# EAGLE design 12c_extender (EAGLE 7.1.0)
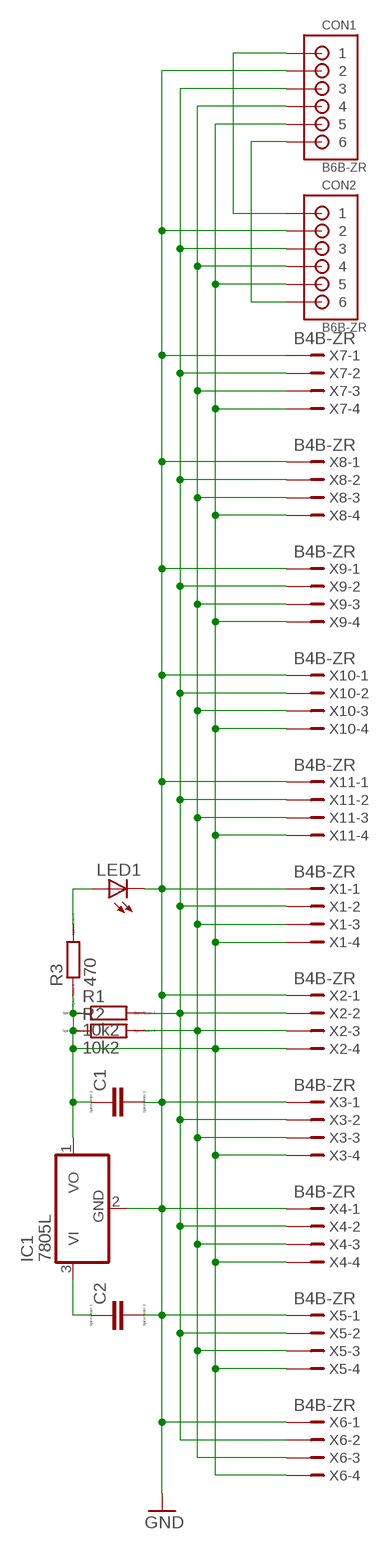
[diagram p0: schematic, sheet 1]

## Parts
C1  C-EUC0805  [C0805]
C2  C-EUC0805  [C0805]
CON1  B6B-ZR  [B6B-ZR]
CON2  B6B-ZR  [B6B-ZR]
IC1  7805L  [TO92]
LED1  LEDSMT1206  [1206]
R1  10k2  R-EU_R0805  [R0805]
R2  10k2  R-EU_R0805  [R0805]
R3  470  R-EU_R0805  [R0805]
X1  B4B-ZR  [B4B-ZR]
X2  B4B-ZR  [B4B-ZR]
X3  B4B-ZR  [B4B-ZR]
X4  B4B-ZR  [B4B-ZR]
X5  B4B-ZR  [B4B-ZR]
X6  B4B-ZR  [B4B-ZR]
X7  B4B-ZR  [B4B-ZR]
X8  B4B-ZR  [B4B-ZR]
X9  B4B-ZR  [B4B-ZR]
X10  B4B-ZR  [B4B-ZR]
X11  B4B-ZR  [B4B-ZR]

## Nets
+5V: C1.1 CON1.5 CON2.5 IC1.1(VO) R1.1 R2.1 R3.1 X1.4 X2.4 X3.4 X4.4 X5.4 X6.4 X7.4 X8.4 X9.4 X10.4 X11.4
GND: C1.2 C2.2 CON1.2 CON2.2 IC1.2(GND) LED1.C X1.1 X2.1 X3.1 X4.1 X5.1 X6.1 X7.1 X8.1 X9.1 X10.1 X11.1
N$1: C2.1 IC1.3(VI)
N$2: LED1.A R3.2
N$3: CON1.1 CON2.1
N$4: CON1.6 CON2.6
SCL: CON1.4 CON2.4 R2.2 X1.3 X2.3 X3.3 X4.3 X5.3 X6.3 X7.3 X8.3 X9.3 X10.3 X11.3
SDA: CON1.3 CON2.3 R1.2 X1.2 X2.2 X3.2 X4.2 X5.2 X6.2 X7.2 X8.2 X9.2 X10.2 X11.2

## Library data of the parts
C1 C2 = resistor:C-EU: CAPACITOR, European symbol; SPICEPREFIX: C
CON1 CON2 = jst:B6B-ZR: JST-ZH Connector 6 pol, 1.5mm pitch Package: B6B-ZR Source: http://www.jst-mfg.com/product/pdf/eng/eZH.pdf
IC1 = linear:78*: Positive VOLTAGE REGULATOR Source: http://cache.national.com/ds/LM/LM78L05.pdf http://www.fairchildsemi.com/ds/LM/LM7805.pdf
LED1 = led:LED: LED OSRAM: - CHIPLED LG R971, LG N971, LY N971, LG Q971, LY Q971, LO R971, LY R971 LH N974, LH R974 LS Q976, LO Q976, LY Q976 LO Q996 - Hyper CHIPLED LW Q18S LB Q993, LB Q99A, LB R99A - SideLED LS A670, LO A670, LY A670, LG A670, LP A670 LB A673, LV A673, LT A673, LW A673 LH A674 LY A675 LS A676, LA A676, LO A676, LY A676, LW A676 LS A679, LY A679, LG A679 - Hyper Micro SIDELED® LS Y876, LA Y876, LO Y876, LY Y876 LT Y87S - SmartLED LW L88C, LW L88S LB L89C, LB L89S, LG L890 LS L89K, LO L89K, LY L89K LS L896, LA L896, LO L896, LY L896 - TOPLED LS T670, LO T670, LY T670, LG T670, LP T670 LSG T670, LSP T670, LSY T670, LOP T670, LYG T670 LG T671, LOG T671, LSG T671 LB T673, LV T673, LT T673, LW T673 LH T674 LS T676, LA T676, LO T676, LY T676, LB T676, LH T676, LSB T676, LW T676 LB T67C, LV T67C, LT T67C, LS T67K, LO T67K, LY T67K, LW E67C LS E67B, LA E67B, LO E67B, LY E67B, LB E67C, LV E67C, LT E67C LW T67C LS T679, LY T679, LG T679 LS T770, LO T770, LY T770, LG T770, LP T770 LB T773, LV T773, LT T773, LW T773 LH T774 LS E675, LA E675, LY E675, LS T675 LS T776, LA T776, LO T776, LY T776, LB T776 LHGB T686 LT T68C, LB T68C - Hyper Mini TOPLED® LB M676 - Mini TOPLED Santana® LG M470 LS M47K, LO M47K, LY M47K Source: http://www.osram.convergy.de LUXEON: - LUMILED® LXK2-PW12-R00, LXK2-PW12-S00, LXK2-PW14-U00, LXK2-PW14-V00 LXK2-PM12-R00, LXK2-PM12-S00, LXK2-PM14-U00 LXK2-PE12-Q00, LXK2-PE12-R00, LXK2-PE12-S00, LXK2-PE14-T00, LXK2-PE14-U00 LXK2-PB12-K00, LXK2-PB12-L00, LXK2-PB12-M00, LXK2-PB14-N00, LXK2-PB14-P00, LXK2-PB14-Q00 LXK2-PR12-L00, LXK2-PR12-M00, LXK2-PR14-Q00, LXK2-PR14-R00 LXK2-PD12-Q00, LXK2-PD12-R00, LXK2-PD12-S00 LXK2-PH12-R00, LXK2-PH12-S00 LXK2-PL12-P00, LXK2-PL12-Q00, LXK2-PL12-R00 Source: www.luxeon.com KINGBRIGHT: KA-3528ASYC Source: www.kingbright.com
R1-R3 = resistor:R-EU_: RESISTOR, European symbol; SPICEPREFIX: R
X1-X11 = con-jst:?4B-ZR: ZH CONNECTOR 1.5 mm, 4 pin 1 row Source: http://www.jst.com .. eZH.pdf; MF: FARNELL; MPN: B4B-ZR(LF)(SN); OC_FARNELL: 1830916; OC_NEWARK: 37K9960

## Board
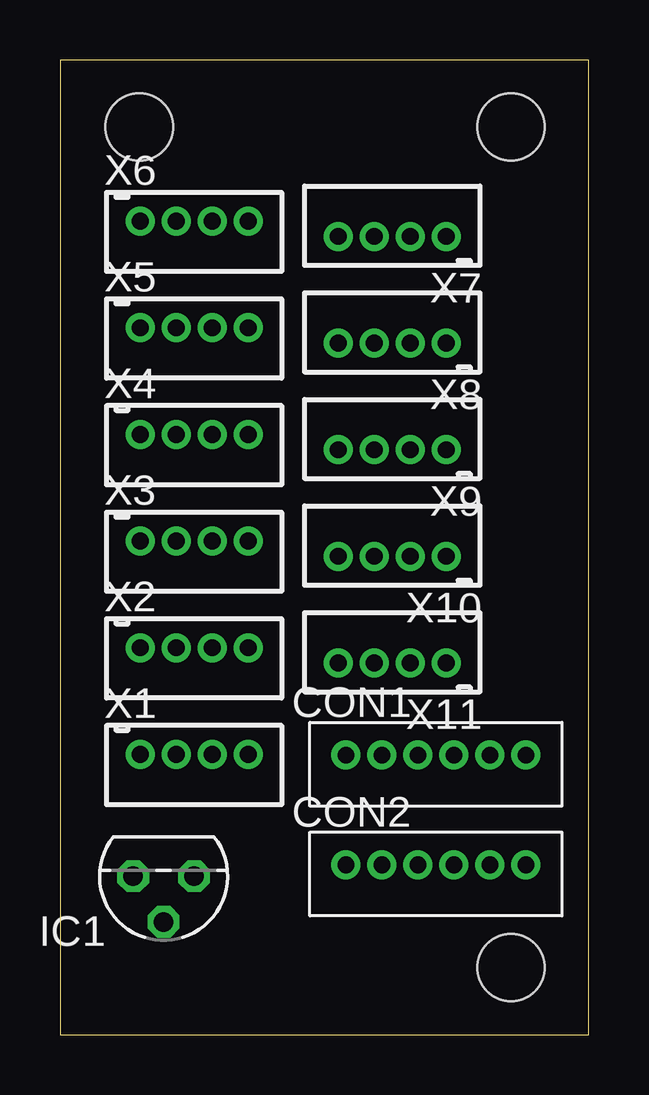
[diagram p1: board, top side]
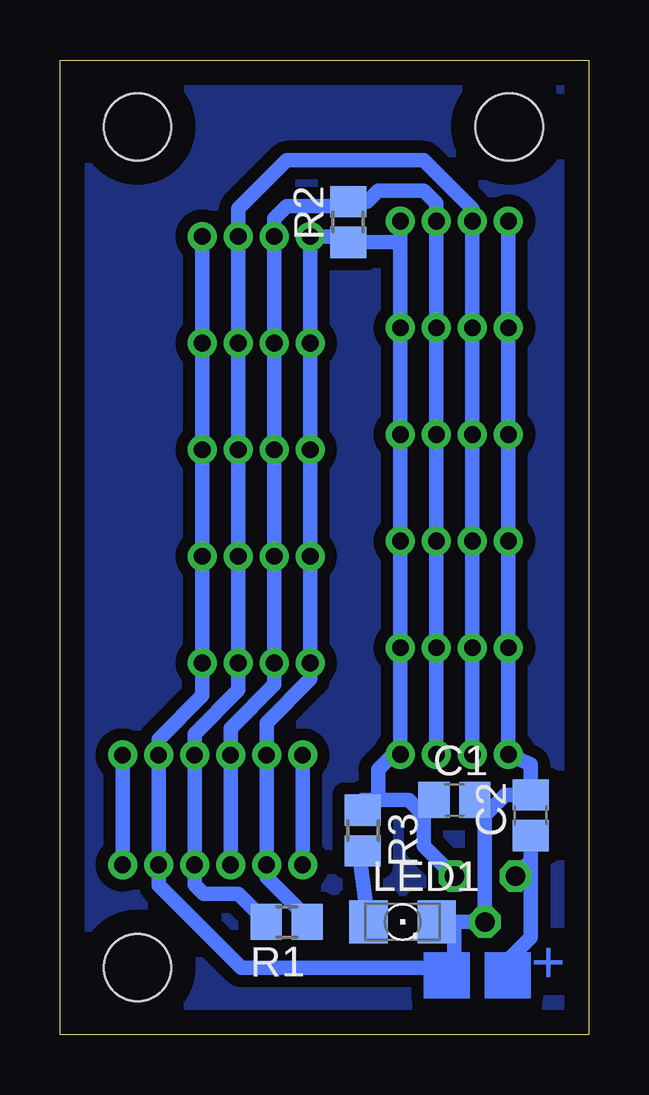
[diagram p2: board, bottom side, seen from below]

Size 22.02 x 40.63 mm. Coordinates in mm from the lower left corner, seen from the top.
Outline: 0,0 22.02,0 22.02,40.63 0,40.63 0,0
Copper layers (1*16): Top 0.035mm / dielectric 1.5mm / Bottom 0.035mm
Design rules "default *": minimum track width 10mil, minimum drill 24mil, track to track 20mil, track to pad 20mil, pad to pad 8mil, via to via 8mil, smd to smd 20mil, copper to edge 40mil, drill to drill 8mil, minimum pad ring 10mil, minimum via ring 8mil, stop-mask expansion 4mil, vias tented up to drill 0mil, thermal gap 10mil
Holes 2.8 mm at 3.3,37.85 18.8,2.79 18.8,37.85

### Footprints (pad centres in the part's own frame; a part is rotated, then mirrored left to right if it is on the bottom)
C0805 = smd 1.3 x 1.5: 1 -0.85,0; 2 0.85,0
B6B-ZR = drill 0.7: 1 9,-1.3; 2 7.5,-1.3; 3 6,-1.3; 4 4.5,-1.3; 5 3,-1.3; 6 1.5,-1.3
TO92 = drill 0.813 octagon: 1 -1.27,0; 2 0,1.905; 3 1.27,0
1206 = smd 1.6 x 1.803: A -1.422,0; C 1.422,0
R0805 = smd 1.3 x 1.5: 1 -0.85,0; 2 0.85,0
B4B-ZR = drill 0.7 pad 1.1: 1 -2.25,0; 2 -0.75,0; 3 0.75,0; 4 2.25,0

### Placement (x,y rotation side)
C1  5.59,9.78 0 bottom
C2  2.41,9.14 90 bottom
CON1  10.41,12.95 0 top
CON2  10.41,8.38 0 top
IC1  4.32,6.6 180 top
LED1  7.75,4.7 0 bottom
R1  12.57,4.7 180 bottom
R2  10.02,33.88 90 bottom
R3  9.4,8.51 270 bottom
X1  5.59,11.68 0 top
X2  5.59,16.13 0 top
X3  5.59,20.57 0 top
X4  5.59,25.02 0 top
X5  5.59,29.46 0 top
X6  5.59,33.91 0 top
X7  13.84,33.27 180 top
X8  13.84,28.83 180 top
X9  13.84,24.38 180 top
X10  13.84,19.94 180 top
X11  13.84,15.49 180 top

### Tracks (layer width: path | path; a pad name or v marks a point on that pad's centre or on a via)
+5V
  Bottom 0.61: X6.4 7.84,33.02 | 7.84,33.02 X5.4 X4.4 X3.4 X2.4 X1.4 8.13,11.68 8.76,11.05 8.76,9.78 | IC1.1 6.86,7.87 6.86,9.14 | 6.86,9.14 7.49,9.78 8.76,9.78 | 8.76,9.78 8.78,9.79 9.4,9.79 R3.1 | C1.1 6.44,9.56 6.86,9.14 | R1.1 11.59,4.83 11.69,4.83 13.41,6.56 CON2.5 CON1.5 13.41,13 11.59,14.82 X11.4 X10.4 X9.4 X8.4 X7.4 10.27,33.27 R2.1 7.84,33.03 7.84,33.02
GND
  Bottom 0.61: X6.1 X5.1 X4.1 X3.1 X2.1 X1.1 2.41,11.26 C2.2 3.47,9.99 4.32,9.14 | X7.1 X8.1 X9.1 X10.1 X11.1 16.09,14.13 17.91,12.31 CON1.2 CON2.2 17.91,6.23 14.48,2.79 5.59,2.79 5.59,4.7 | 4.32,9.14 IC1.2 5.59,4.7 | 5.59,4.7 LED1.C | C1.2 4.74,9.56 4.32,9.14
N$1
  Bottom 0.61: 2.41,7.24 IC1.3 | C2.1 2.41,7.24 | 2.41,7.24 2.41,4.06 3.68,2.79
N$2
  Bottom 0.61: LED1.A 9.55,7.51 R3.2
N$3
  Bottom 0.61: CON1.1 CON2.1
N$4
  Bottom 0.61: CON2.6 CON1.6
N$5
  pour Bottom: 0,40.39 22.1,40.39 22.1,0 0,0
SCL
  Bottom 0.61: X1.3 X2.3 X3.3 X4.3 X5.3 X6.3 6.34,34.66 6.86,35.18 8.76,35.18 9.22,34.73 R2.2 10.2,34.54 12.57,34.54 13.09,34.02 X7.3 X8.3 X9.3 X10.3 X11.3 13.09,14.59 14.91,12.77 CON1.4 CON2.4
SDA
  Bottom 0.61: X1.2 X2.2 X3.2 X4.2 X5.2 X6.2 4.84,34.43 6.86,36.45 12.57,36.45 14.59,34.43 X7.2 X8.2 X9.2 X10.2 X11.2 14.59,14.36 16.41,12.54 CON1.3 CON2.3 16.41,6.25 16.03,5.87 14.59,5.87 R1.2
(copper drawn outside any net)
  shapes: Bottom area x2

### Text on the board
Bottom: +